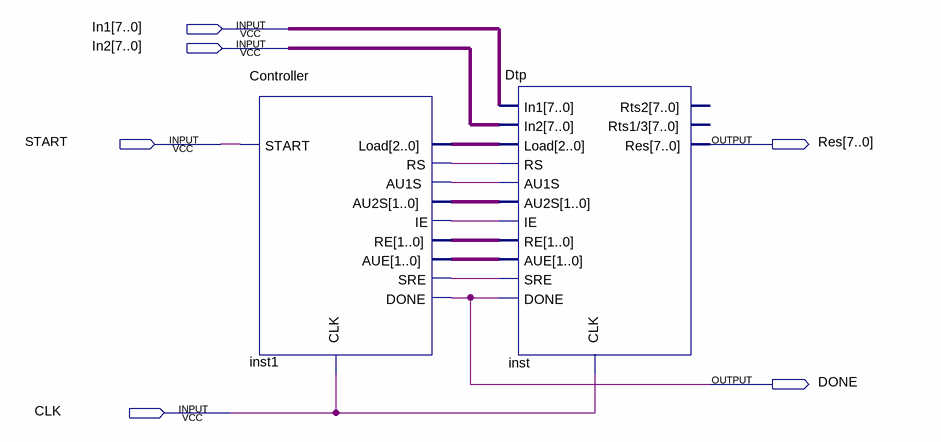
[diagram p0: schematic sheet]
// Quartus schematic RM.bdf as structural Verilog: 2 symbols, 6 pins
module RM (
  input  [7:0] In1,
  input  [7:0] In2,
  input  START,
  input  CLK,
  output [7:0] Res,
  output DONE
);

  wire inst1_au1s, inst1_ie, inst1_rs, inst1_sre;
  wire [1:0] inst1_au2s, inst1_aue, inst1_re;
  wire [2:0] inst1_load;

  Controller inst1 (
    .START(START), .CLK(CLK), .Load(inst1_load), .RS(inst1_rs), .AU1S(inst1_au1s), .AU2S(inst1_au2s),
    .IE(inst1_ie), .RE(inst1_re), .AUE(inst1_aue), .SRE(inst1_sre), .DONE(DONE));
  Dtp inst (
    .In1(In1), .In2(In2), .Load(inst1_load), .RS(inst1_rs), .AU1S(inst1_au1s), .AU2S(inst1_au2s),
    .IE(inst1_ie), .RE(inst1_re), .AUE(inst1_aue), .SRE(inst1_sre), .DONE(DONE), .CLK(CLK), .Res(Res));  // open: Rts2, Rts1/3
endmodule
